# EAGLE schematic Control (EAGLE 9.6.2)
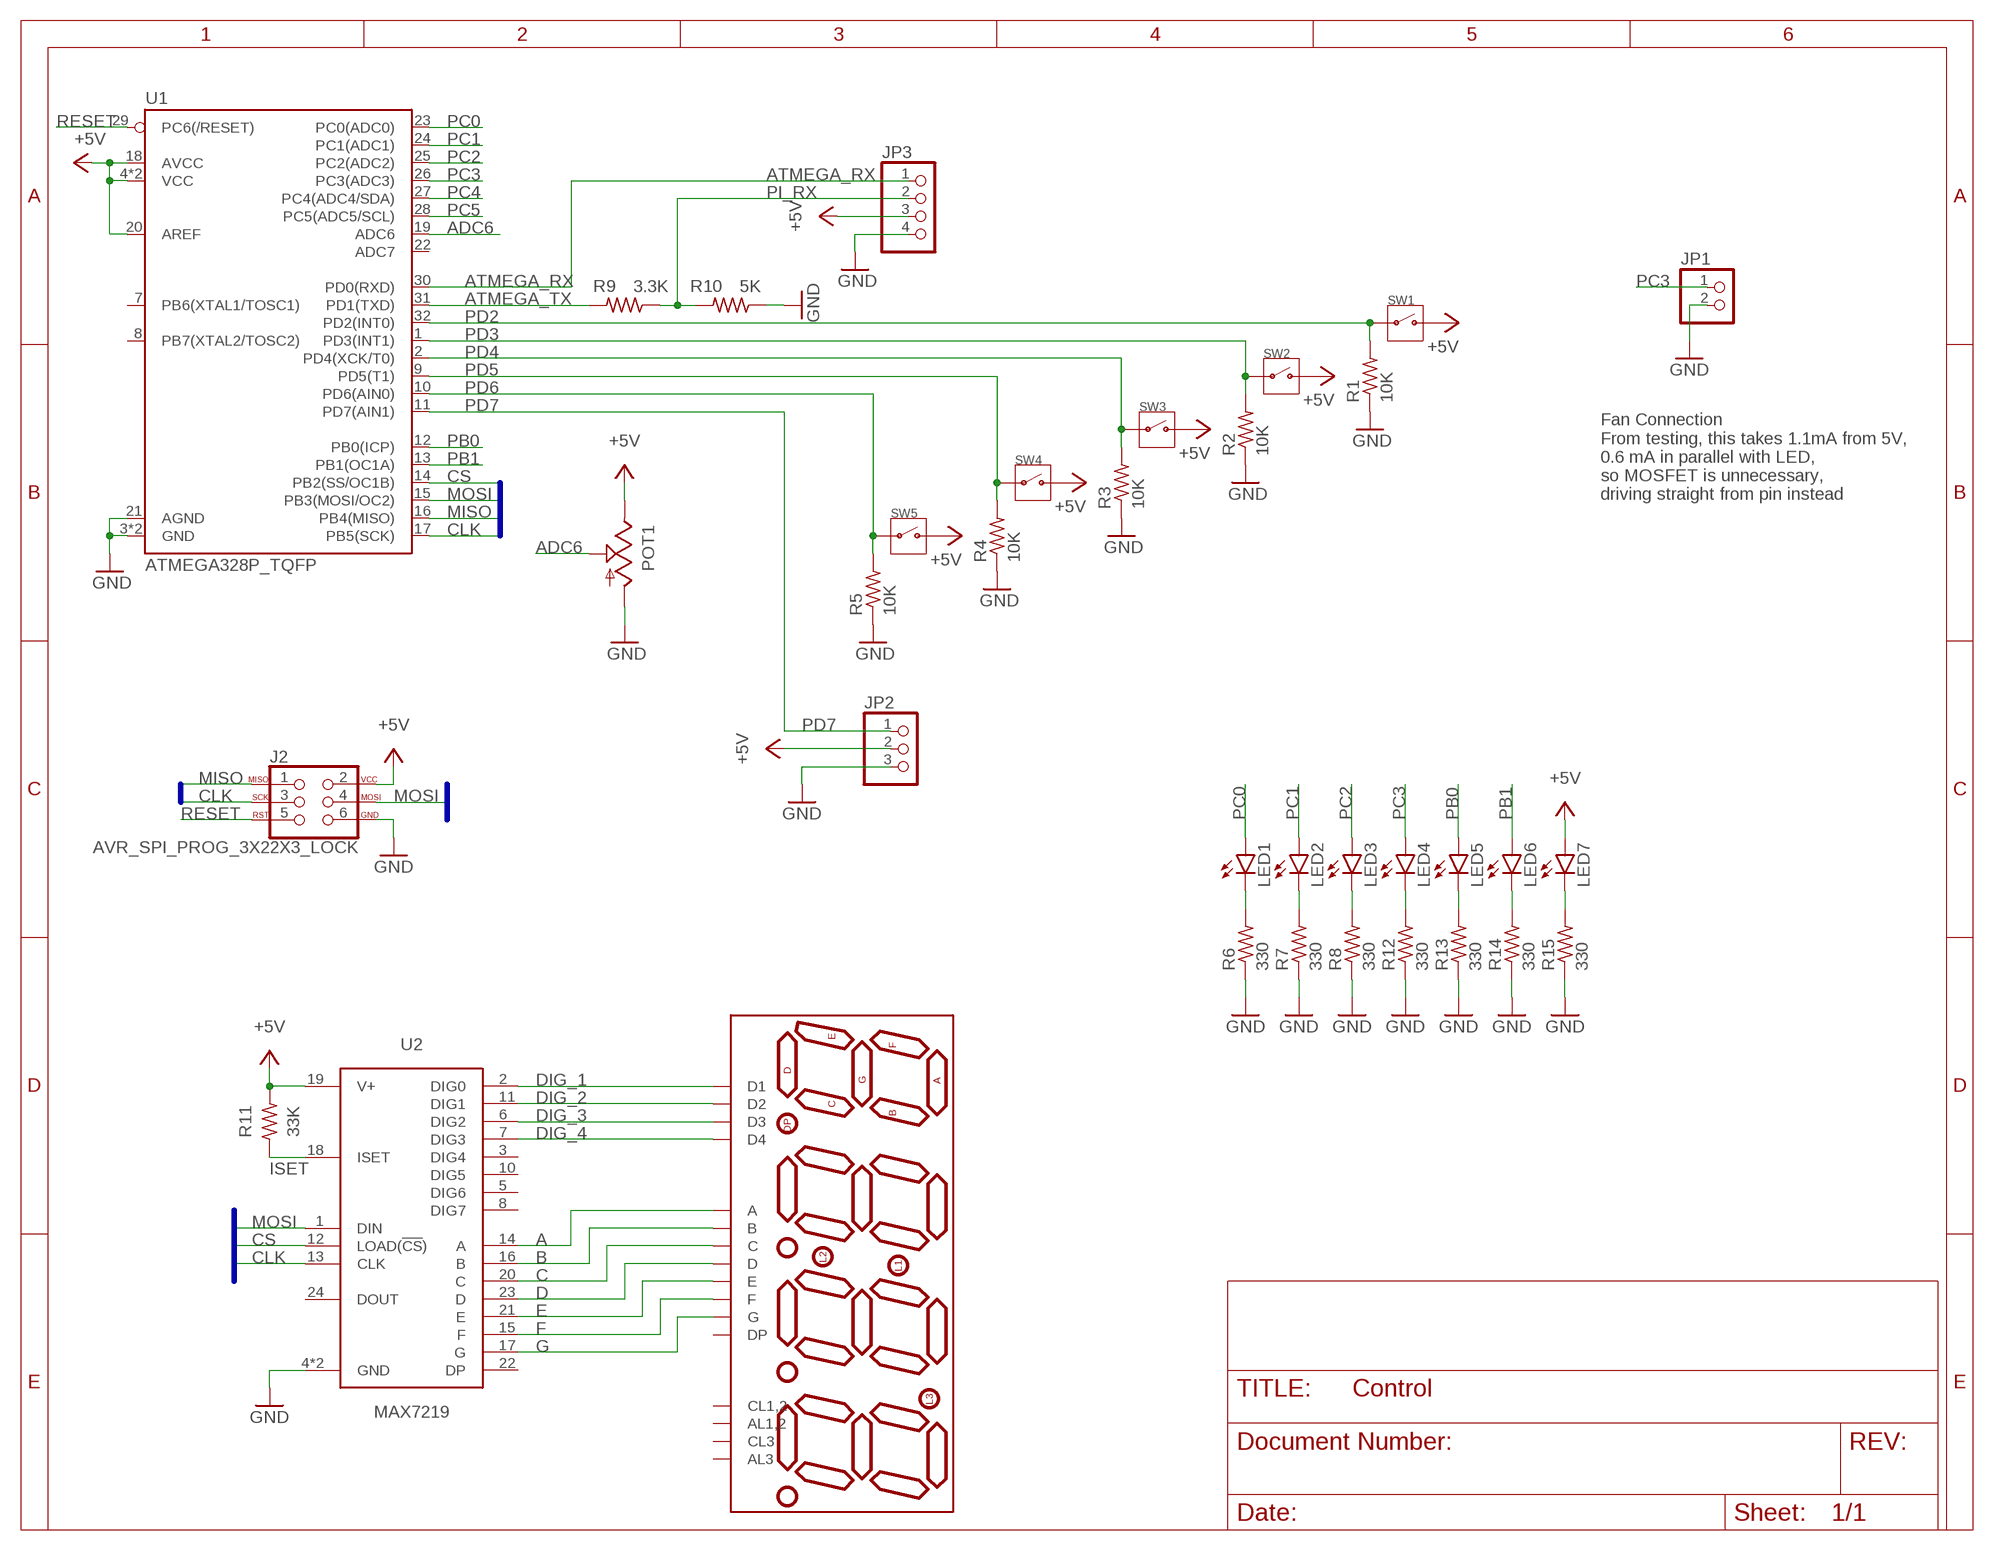
[diagram p0: schematic, sheet 1]

## Parts
DS1  TDCG1060M_COMMONCATHODE  [TDCG1060M]
J2  AVR_SPI_PROG_3X22X3_LOCK  [2X3_LOCK]
JP1  PINHD-1X2  [1X02]
JP2  PINHD-1X3  [1X03]
JP3  PINHD-1X4  [1X04]
LED1  LEDCHIP-LED0603  [CHIP-LED0603]
LED2  LEDCHIP-LED0603  [CHIP-LED0603]
LED3  LEDCHIP-LED0603  [CHIP-LED0603]
LED4  LEDCHIP-LED0603  [CHIP-LED0603]
LED5  LEDCHIP-LED0603  [CHIP-LED0603]
LED6  LEDCHIP-LED0603  [CHIP-LED0603]
LED7  LEDCHIP-LED0603  [CHIP-LED0603]
POT1  POT_PTV09A-4225F-B103  [POT_PTV09A-4225F-B103]
R1  10K  R-US_R0603  [R0603]
R2  10K  R-US_R0603  [R0603]
R3  10K  R-US_R0603  [R0603]
R4  10K  R-US_R0603  [R0603]
R5  10K  R-US_R0603  [R0603]
R6  330  R-US_R0603  [R0603]
R7  330  R-US_R0603  [R0603]
R8  330  R-US_R0603  [R0603]
R9  3.3K  R-US_R0603  [R0603]
R10  5K  R-US_R0603  [R0603]
R11  33K  R-US_R0603  [R0603]
R12  330  R-US_R0603  [R0603]
R13  330  R-US_R0603  [R0603]
R14  330  R-US_R0603  [R0603]
R15  330  R-US_R0603  [R0603]
SW1  BUTTON  [B3F-1000]
SW2  BUTTON  [B3F-1000]
SW3  BUTTON  [B3F-1000]
SW4  BUTTON  [B3F-1000]
SW5  BUTTON  [B3F-1000]
U1  ATMEGA328P_TQFP  [TQFP32-08]
U2  MAX7219  [SOIC127P1032X265-24N]

## Nets
+5V: J2.2 JP2.2 JP3.3 LED7.A POT1.3(E) R11.2 SW1.3 SW1.4 SW2.3 SW2.4 SW3.3 SW3.4 SW4.3 SW4.4 SW5.3 SW5.4 U1.4(VCC) U1.6(VCC) U1.18(AVCC) U1.20(AREF) U2.19(V+)
A: DS1.14(A) U2.14(A)
ADC6: POT1.2(S) U1.19(ADC6)
ATMEGA_RX: JP3.1 U1.30(PD0(RXD))
ATMEGA_TX: R9.2 U1.31(PD1(TXD))
B: DS1.16(B) U2.16(B)
C: DS1.13(C) U2.20(C)
CLK: J2.3 U1.17(PB5(SCK)) U2.13(CLK)
CS: U1.14(PB2(SS/OC1B)) U2.12(LOAD(!CS!))
D: DS1.3(D) U2.23(D)
DIG_1: DS1.1(D1) U2.2(DIG0)
DIG_2: DS1.2(D2) U2.11(DIG1)
DIG_3: DS1.6(D3) U2.6(DIG2)
DIG_4: DS1.8(D4) U2.7(DIG3)
E: DS1.5(E) U2.21(E)
F: DS1.11(F) U2.15(F)
G: DS1.15(G) U2.17(G)
GND: J2.6 JP1.2 JP2.3 JP3.4 POT1.1(A) R1.1 R2.1 R3.1 R4.1 R5.1 R6.1 R7.1 R8.1 R10.1 R12.1 R13.1 R14.1 R15.1 U1.3(GND) U1.5(GND) U1.21(AGND) U2.4(GND) U2.9(GND)
ISET: R11.1 U2.18(ISET)
MISO: J2.1 U1.16(PB4(MISO))
MOSI: J2.4 U1.15(PB3(MOSI/OC2)) U2.1(DIN)
N$1: LED1.C R6.2
N$2: LED2.C R7.2
N$3: LED3.C R8.2
N$4: LED4.C R12.2
N$5: LED5.C R13.2
N$6: LED6.C R14.2
N$7: LED7.C R15.2
PB0: LED5.A U1.12(PB0(ICP))
PB1: LED6.A U1.13(PB1(OC1A))
PC0: LED1.A U1.23(PC0(ADC0))
PC1: LED2.A U1.24(PC1(ADC1))
PC2: LED3.A U1.25(PC2(ADC2))
PC3: JP1.1 LED4.A U1.26(PC3(ADC3))
PC4: U1.27(PC4(ADC4/SDA))
PC5: U1.28(PC5(ADC5/SCL))
PD2: R1.2 SW1.1 SW1.2 U1.32(PD2(INT0))
PD3: R2.2 SW2.1 SW2.2 U1.1(PD3(INT1))
PD4: R3.2 SW3.1 SW3.2 U1.2(PD4(XCK/T0))
PD5: R4.2 SW4.1 SW4.2 U1.9(PD5(T1))
PD6: R5.2 SW5.1 SW5.2 U1.10(PD6(AIN0))
PD7: JP2.1 U1.11(PD7(AIN1))
PI_RX: JP3.2 R9.1 R10.2
RESET: J2.5 U1.29(PC6(/RESET))
Unconnected: DS1.4(CL1,2) DS1.7(DP) DS1.9(AL3) DS1.10(CL3) DS1.12(AL1,2) U1.7(PB6(XTAL1/TOSC1)) U1.8(PB7(XTAL2/TOSC2)) U1.22(ADC7) U2.3(DIG4) U2.5(DIG6) U2.8(DIG7) U2.10(DIG5) U2.22(DP) U2.24(DOUT)

## Buses
SPI:CLK,CS,MISO,MOSI

## Notes on the sheet
- Fan Connection
  From testing, this takes 1.1mA from 5V,
  0.6 mA in parallel with LED,
  so MOSFET is unnecessary,
  driving straight from pin instead

## Library data of the parts
DS1 = 7-segment display_10mm_LDQ-M282RI:TDCG1060M_COMMONCATHODE
J2 = SparkFun-Connectors:AVR_SPI_PROG_3X2: AVR ISP 6 Pin This is the reduced ISP connector for AVR programming. Common on Arduino. This footprint will take up less PCB space and can be used with a 10-pin to 6-pin adapter such as SKU: BOB-08508 **Special note about "TEST_POINT" package. The stop mask is on the top side, so if you want your programming test points to be on the bottom of your board, make sure to place this package on the bottom side of the board. This also ensure that the orientation to program from the bottom side will be correct. SparkFun Products: SparkFun ISP Pogo Adapter <https://www.sparkfun.com/products/11591> - NS Tiny AVR Programmer <https://www.sparkfun.com/products/11801> -PTH
JP1 = pinhead:PINHD-1X2: PIN HEADER
JP2 = pinhead:PINHD-1X3: PIN HEADER
JP3 = pinhead:PINHD-1X4: PIN HEADER
LED1-LED7 = led:LED: LED OSRAM: - CHIPLED LG R971, LG N971, LY N971, LG Q971, LY Q971, LO R971, LY R971 LH N974, LH R974 LS Q976, LO Q976, LY Q976 LO Q996 - Hyper CHIPLED LW Q18S LB Q993, LB Q99A, LB R99A - SideLED LS A670, LO A670, LY A670, LG A670, LP A670 LB A673, LV A673, LT A673, LW A673 LH A674 LY A675 LS A676, LA A676, LO A676, LY A676, LW A676 LS A679, LY A679, LG A679 - Hyper Micro SIDELED® LS Y876, LA Y876, LO Y876, LY Y876 LT Y87S - SmartLED LW L88C, LW L88S LB L89C, LB L89S, LG L890 LS L89K, LO L89K, LY L89K LS L896, LA L896, LO L896, LY L896 - TOPLED LS T670, LO T670, LY T670, LG T670, LP T670 LSG T670, LSP T670, LSY T670, LOP T670, LYG T670 LG T671, LOG T671, LSG T671 LB T673, LV T673, LT T673, LW T673 LH T674 LS T676, LA T676, LO T676, LY T676, LB T676, LH T676, LSB T676, LW T676 LB T67C, LV T67C, LT T67C, LS T67K, LO T67K, LY T67K, LW E67C LS E67B, LA E67B, LO E67B, LY E67B, LB E67C, LV E67C, LT E67C LW T67C LS T679, LY T679, LG T679 LS T770, LO T770, LY T770, LG T770, LP T770 LB T773, LV T773, LT T773, LW T773 LH T774 LS E675, LA E675, LY E675, LS T675 LS T776, LA T776, LO T776, LY T776, LB T776 LHGB T686 LT T68C, LB T68C - Hyper Mini TOPLED® LB M676 - Mini TOPLED Santana® LG M470 LS M47K, LO M47K, LY M47K Source: http://www.osram.convergy.de LUXEON: - LUMILED® LXK2-PW12-R00, LXK2-PW12-S00, LXK2-PW14-U00, LXK2-PW14-V00 LXK2-PM12-R00, LXK2-PM12-S00, LXK2-PM14-U00 LXK2-PE12-Q00, LXK2-PE12-R00, LXK2-PE12-S00, LXK2-PE14-T00, LXK2-PE14-U00 LXK2-PB12-K00, LXK2-PB12-L00, LXK2-PB12-M00, LXK2-PB14-N00, LXK2-PB14-P00, LXK2-PB14-Q00 LXK2-PR12-L00, LXK2-PR12-M00, LXK2-PR14-Q00, LXK2-PR14-R00 LXK2-PD12-Q00, LXK2-PD12-R00, LXK2-PD12-S00 LXK2-PH12-R00, LXK2-PH12-S00 LXK2-PL12-P00, LXK2-PL12-Q00, LXK2-PL12-R00 Source: www.luxeon.com KINGBRIGHT: KA-3528ASYC Source: www.kingbright.com
POT1 = in_pot_PTV09A-4225F-B103:POT_PTV09A-4225F-B103
R1-R15 = rcl:R-US_: RESISTOR, American symbol; SPICEPREFIX: R
SW1-SW5 = pushbutton:BUTTON
U1 = SparkFun-IC-Microcontroller:ATMEGA328P_TQFP: Popular 328P in QFP Storefront component: ATmega328 - TQFP <https://www.sparkfun.com/products/13448> (COM-13448) Datasheet <http://www.sparkfun.com/datasheets/Components/SMD/ATMega328.pdf> SparkFun Products SparkFun RedBoard - Programmed with Arduino <https://www.sparkfun.com/products/12757> (DEV-12757) Arduino Pro Mini 328 - 5V/16MHz <https://www.sparkfun.com/products/11113> (DEV-11113) Arduino Pro Mini 328 - 3.3V/8MHz <https://www.sparkfun.com/products/11114> (DEV-11114) SparkFun OpenLog <https://www.sparkfun.com/products/13712> (DEV-13712) SparkFun MicroView - OLED Arduino Module <https://www.sparkfun.com/products/12923> (DEV-12923) SparkFun Digital Sandbox <https://www.sparkfun.com/products/12651> (DEV-12651) SparkFun PicoBoard <https://www.sparkfun.com/products/11888> (WIG-11888) Arduino Fio <https://www.sparkfun.com/products/10116> (DEV-10116) LilyPad Arduino 328 Main Board <https://www.sparkfun.com/products/13342> (DEV-13342) SparkFun RedStick <https://www.sparkfun.com/products/13741> (DEV-13741) LilyPad MP3 <https://www.sparkfun.com/products/11013> (DEV-11013) LilyPad Arduino SimpleSnap <https://www.sparkfun.com/products/10941> (DEV-10941) SparkFun Stepoko <https://www.sparkfun.com/products/13899> (ROB-13899) SparkFun Geiger Counter <https://www.sparkfun.com/products/11345> (SEN-11345) SparkFun EL Sequencer <https://www.sparkfun.com/products/12781> (COM-12781) Arduino Pro 328 - 5V/16MHz <https://www.sparkfun.com/products/10915> (DEV-10915) CryptoCape <https://www.sparkfun.com/products/12773> (DEV-12773) SparkFun IR Thermometer Evaluation Board - MLX90614 <https://www.sparkfun.com/products/10740> (SEN-10740) SparkFun RedBot Mainboard <https://www.sparkfun.com/products/12097> (ROB-12097) Arduino Pro 328 - 3.3V/8MHz <https://www.sparkfun.com/products/10914> (DEV-10914) SparkFun Block for Intel® Edison - Arduino <https://www.sparkfun.com/products/13036> (DEV-13036) SparkFun Simon Says - Surface Mount Soldering Kit <https://www.sparkfun.com/products/10935> (KIT-10935) SparkFun 7-Segment Serial Display - Red <https://www.sparkfun.com/products/11441> (COM-11441) SparkFun 7-Segment Serial Display - White <https://www.sparkfun.com/products/11629> (COM-11629) SparkFun 7-Segment Serial Display - Yellow <https://www.sparkfun.com/products/11443> (COM-11443) SparkFun 7-Segment Serial Display - Kelly Green <https://www.sparkfun.com/products/11440> (COM-11440) SparkFun 7-Segment Serial Display - Blue <https://www.sparkfun.com/products/11442> (COM-11442) SparkFun OpenSegment Serial Display - 20mm (Blue) <https://www.sparkfun.com/products/11647> (COM-11647) SparkFun OpenSegment Serial Display - 20mm (Green) <https://www.sparkfun.com/products/11646> (COM-11646) SparkFun OpenSegment Serial Display - 20mm (White) <https://www.sparkfun.com/products/11648> (COM-11648) SparkFun OpenSegment Serial Display - 20mm (Red) <https://www.sparkfun.com/products/11644> (COM-11644) SparkFun OpenSegment Serial Display - 20mm (Yellow) <https://www.sparkfun.com/products/11645> (COM-11645) SparkFun OpenSegment Shield <https://www.sparkfun.com/products/13190> (DEV-13190); PROD_ID: IC-09069
U2 = comm_8 segment display driver_MAX7219:MAX7219